# Altium schematic sheet pico.SchDoc: Pico
size C; DocumentNumber: 1; SheetNumber: 1; SheetTotal: 2
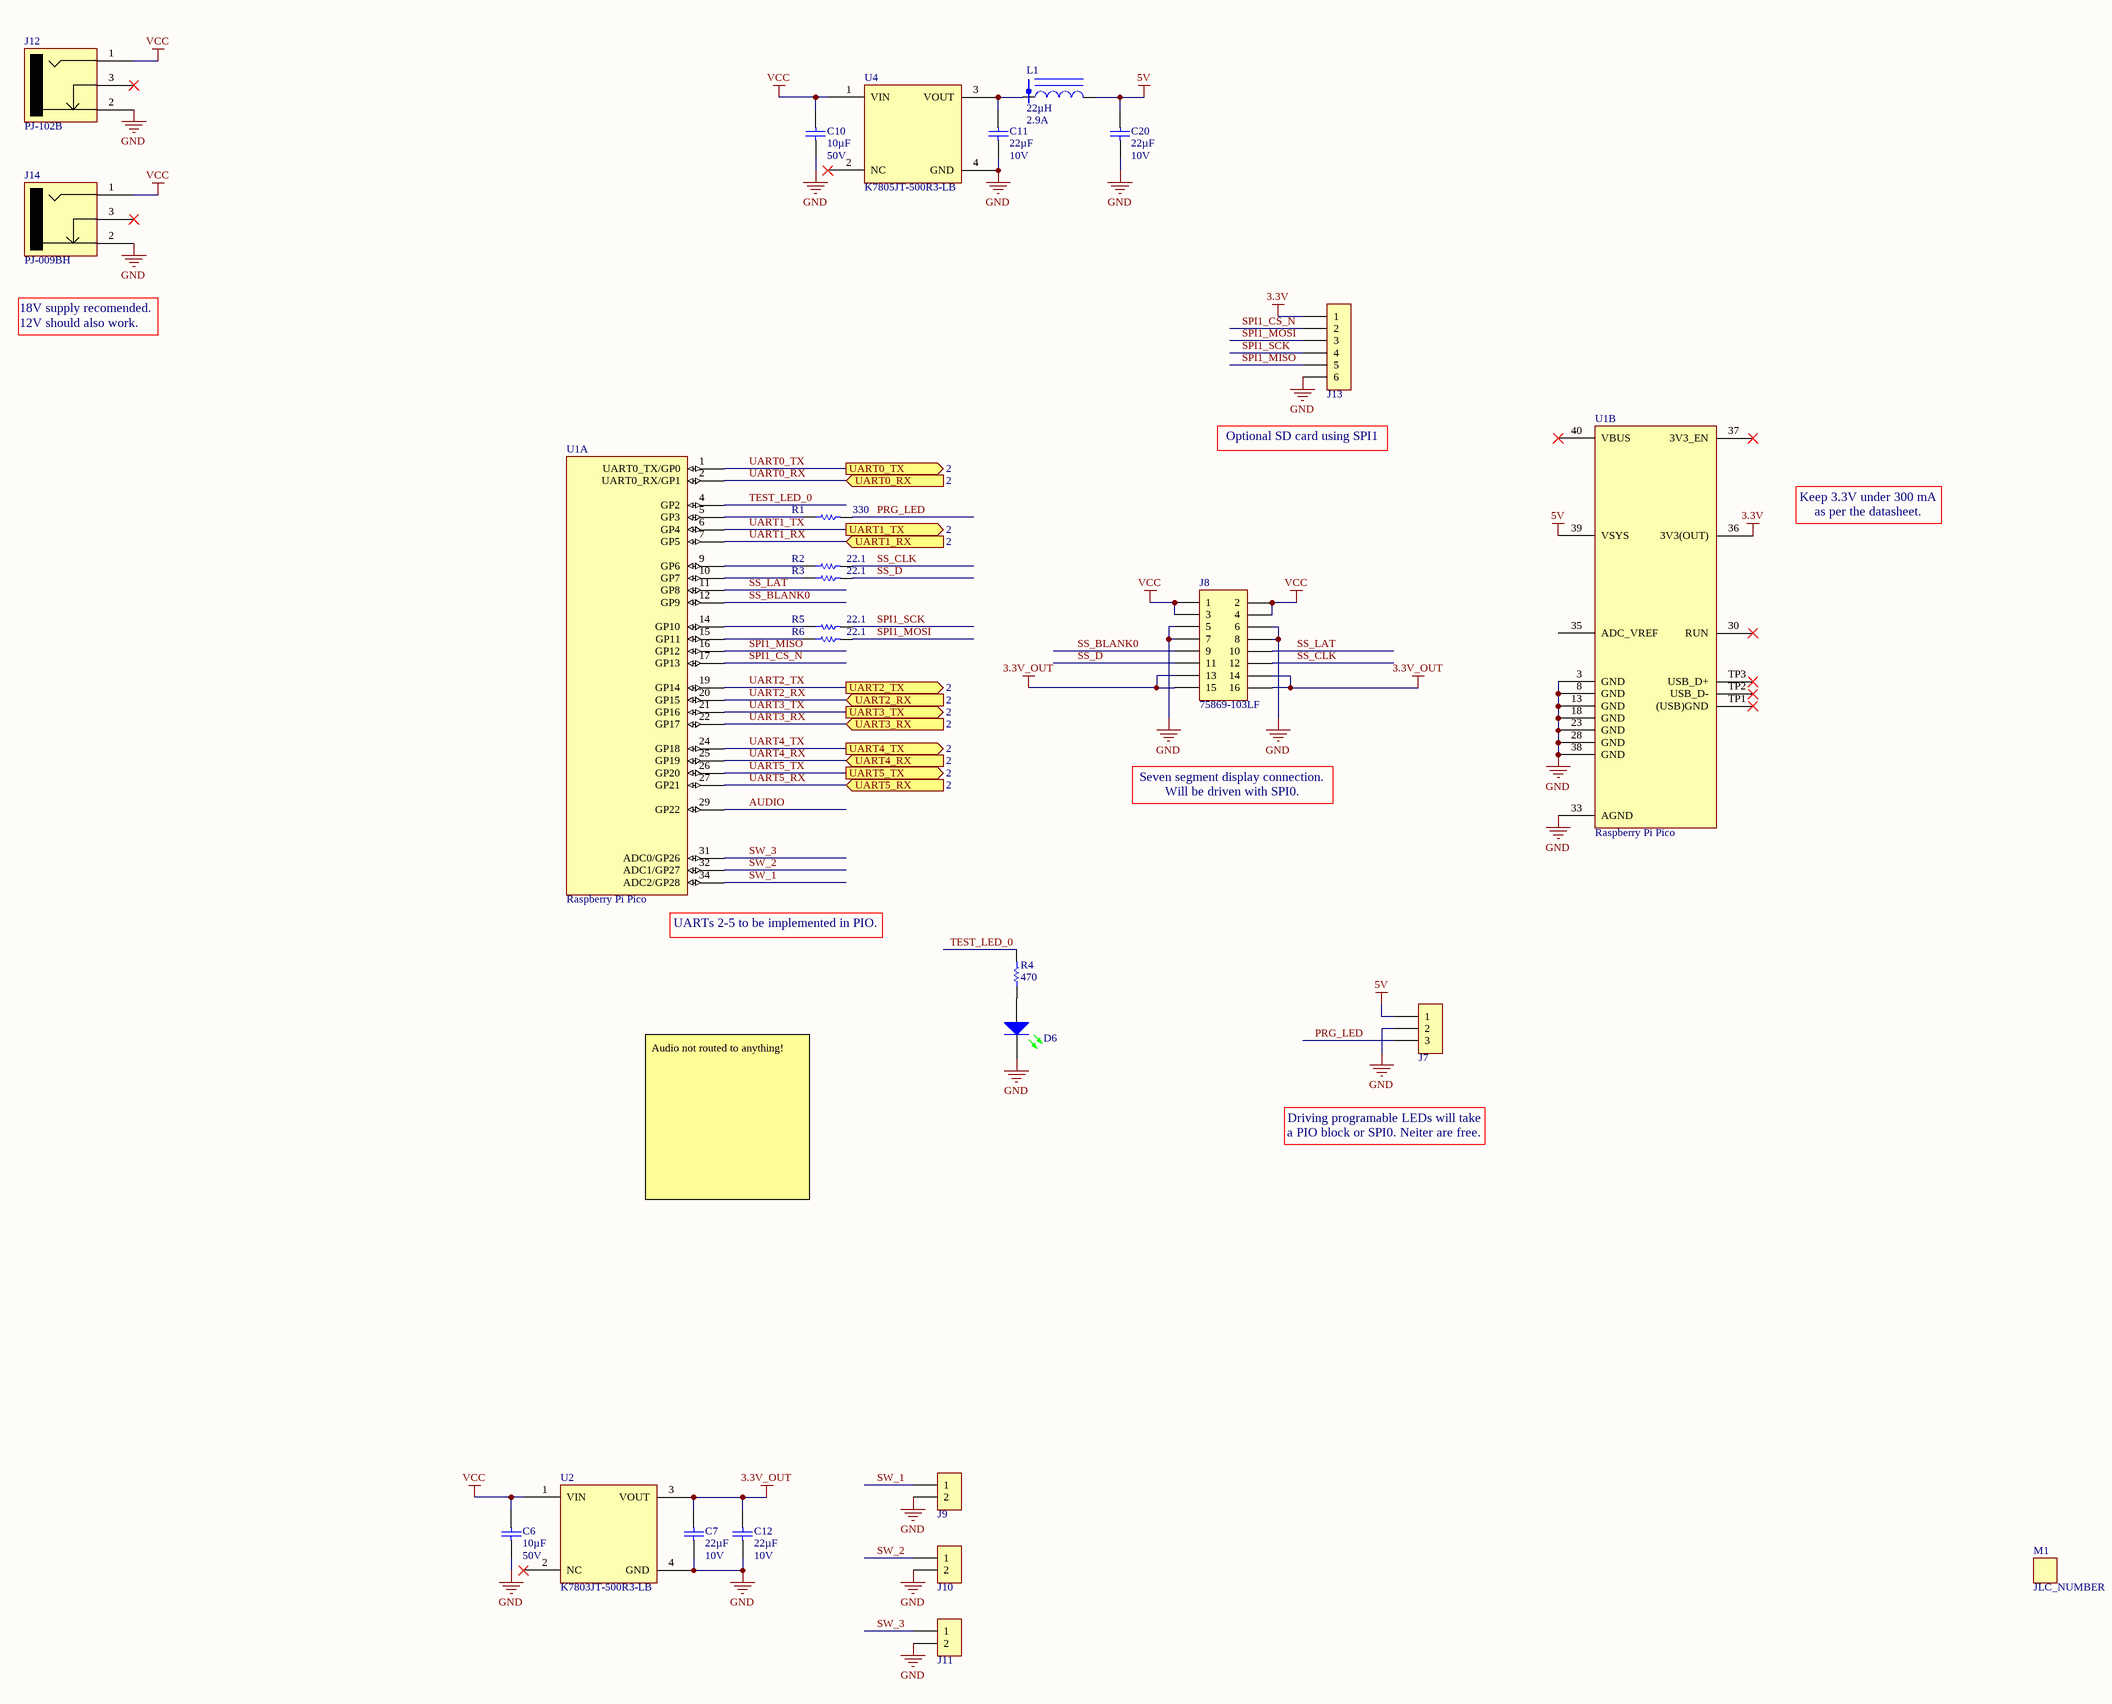
[diagram p0: pico.SchDoc]

## Parts
C6  10µF  Voltage: 50V  [Chip1206]
C7  22µF  Voltage: 10V  [Chip0805]
C10  10µF  Voltage: 50V  [Chip1206]
C11  22µF  Voltage: 10V  [Chip0805]
C12  22µF  Voltage: 10V  [Chip0805]
C20  22µF  Voltage: 10V  [Chip0805]
D6  GREEN  [LED0603]  (value not drawn)
J7  3-644456-3  [TE_3-644456-3]  (value not drawn)
J8  75869-103LF  [IDC_100_2x8]
J9  B2B-XH-A  [JST_B2B-XH-A]  (value not drawn)
J10  B2B-XH-A  [JST_B2B-XH-A]  (value not drawn)
J11  B2B-XH-A  [JST_B2B-XH-A]  (value not drawn)
J12  PJ-102B  [CUI_PJ-102B]
J13  3-644456-6  [TE_3-644456-6]  (value not drawn)
J14  PJ-009BH  [CUI_PJ-009BH]
L1  22µH  Current Rating: 2.9A  [Sumida_CDRH105R]
M1  JLC_NUMBER  [JLC_NUMBER]  (no BOM)
R1  330  [Chip0805]
R2  22.1  [Chip0805]
R3  22.1  [Chip0805]
R4  470  [Chip0805]
R5  22.1  [Chip0805]
R6  22.1  [Chip0805]
U1  Raspberry Pi Pico  [RASPBERRY_PI_PICO]  (parts A,B of 2)
U2  K7803JT-500R3-LB  [MORNSUN_K78XXJT-500R3-LB]
U4  K7805JT-500R3-LB  [MORNSUN_K78XXJT-500R3-LB]

## Ports
UART0_RX (in, see 2), UART0_TX (out, see 2), UART1_RX (in, see 2), UART1_TX (out, see 2), UART2_RX (in, see 2), UART2_TX (out, see 2), UART3_RX (in, see 2), UART3_TX (out, see 2), UART4_RX (in, see 2), UART4_TX (out, see 2), UART5_RX (in, see 2), UART5_TX (out, see 2)

## Nets
3.3V: J13.1 U1.36(3V3(OUT))
3.3V_OUT: C7.2 C12.2 J8.13 J8.14 J8.15 J8.16 U2.3(VOUT)
5V: C20.2 J7.1 L1.2 U1.39(VSYS)
GND: C6.1 C7.1 C10.1 C11.1 C12.1 C20.1 D6.2(C) J7.2 J8.5 J8.6 J8.7 J8.8 J9.2 J10.2 J11.2 J12.2 J13.6 J14.2 U1.3(GND) U1.8(GND) U1.13(GND) U1.18(GND) U1.23(GND) U1.28(GND) U1.33(AGND) U1.38(GND) U2.4(GND) U4.4(GND)
VCC: C6.2 C10.2 J8.1 J8.2 J8.3 J8.4 J12.1 J14.1 U2.1(VIN) U4.1(VIN)
AUDIO: U1.29(GP22)
PRG_LED: J7.3 R1.2
SPI1_CS_N: J13.2 U1.17(GP13)
SPI1_MISO: J13.5 U1.16(GP12)
SPI1_MOSI: J13.3 R6.2
SPI1_SCK: J13.4 R5.2
SS_BLANK0: J8.9 U1.12(GP9)
SS_CLK: J8.12 R2.2
SS_D: J8.11 R3.2
SS_LAT: J8.10 U1.11(GP8)
SW_1: J9.1 U1.34(ADC2/GP28)
SW_2: J10.1 U1.32(ADC1/GP27)
SW_3: J11.1 U1.31(ADC0/GP26)
TEST_LED_0: R4.2 U1.4(GP2)
UART0_RX: U1.2(UART0_RX/GP1) ; port UART0_RX
UART0_TX: U1.1(UART0_TX/GP0) ; port UART0_TX
UART1_RX: U1.7(GP5) ; port UART1_RX
UART1_TX: U1.6(GP4) ; port UART1_TX
UART2_RX: U1.20(GP15) ; port UART2_RX
UART2_TX: U1.19(GP14) ; port UART2_TX
UART3_RX: U1.22(GP17) ; port UART3_RX
UART3_TX: U1.21(GP16) ; port UART3_TX
UART4_RX: U1.25(GP19) ; port UART4_RX
UART4_TX: U1.24(GP18) ; port UART4_TX
UART5_RX: U1.27(GP21) ; port UART5_RX
UART5_TX: U1.26(GP20) ; port UART5_TX
NetC11_2: C11.2 L1.1 U4.3(VOUT)
NetD6_1: D6.1(A) R4.1
NetR1_1: R1.1 U1.5(GP3)
NetR2_1: R2.1 U1.9(GP6)
NetR3_1: R3.1 U1.10(GP7)
NetR5_1: R5.1 U1.14(GP10)
NetR6_1: R6.1 U1.15(GP11)

Not connected (* = marked no-connect by the designer): J12 3*; J14 3*; U1 30(RUN)* 35(ADC_VREF) 37(3V3_EN)* 40(VBUS)* TP1((USB)GND)* TP2(USB_D-)* TP3(USB_D+)*; U2 2(NC)*; U4 2(NC)*

## Notes on the sheet
- 18V supply recomended. 12V should also work.
- Optional SD card using SPI1
- Keep 3.3V under 300 mA as per the datasheet.
- Seven segment display connection. Will be driven with SPI0.
- (near U1) UARTs 2-5 to be implemented in PIO.
- Driving programable LEDs will take a PIO block or SPI0. Neiter are free.
- Audio not routed to anything!
- Title:
- This work is licensed under a Creative Commons Attribution 4.0 International License. Derivative works should remove all Sophistry branding and ‘é’ watermark.
- Date:
- Engineer:
- Revision:
- Codename:
- Time:
- Variant:
- Sheet
- of

## Library data of the parts
C6 C10 = C3216X5R1H106K160AB: CAP CER 10UF 50V 10% X5R 1206; Manufacturer: TDK Corporation; PartNumber: C3216X5R1H106K160AB; HelpURL: http://product.tdk.com/capacitor/mlcc/en/documents/mlcc_commercial_general_en.pdf; Supplier 1: Digi-Key; Supplier Part Number 1: 445-5998-1-ND; Supplier 2: Mouser; Manufacturer Part Number: C3216X5R1H106K160AB; Series: C; Capacitance: 10µF; Tolerance: ±10%; Temperature Coefficient: X5R; Mounting Type: Surface Mount, MLCC; Operating Temperature: -55°C ~ 85°C; Applications: General Purpose; Ratings: -; Package / Case: 1206 (3216 Metric); Size / Dimension: 0.126" L x 0.063" W (3.20mm x 1.60mm); Height - Seated (Max): -; Thickness (Max): 0.071" (1.80mm); Lead Spacing: -; Features: -; Lead Style: -
C7 C11 C12 C20 = C2012X5R1A226M085AC: CAP CER 22UF 10V 20% X5R 0805; Manufacturer: TDK Corporation; PartNumber: C2012X5R1A226M085AC; HelpURL: http://product.tdk.com/capacitor/mlcc/en/documents/mlcc_commercial_general_en.pdf; Supplier 1: Digi-Key; Supplier Part Number 1: 445-7663-1-ND; Supplier 2: Mouser; Manufacturer Part Number: C2012X5R1A226M085AC; Series: C; Capacitance: 22µF; Tolerance: ±20%; Temperature Coefficient: X5R; Mounting Type: Surface Mount, MLCC; Operating Temperature: -55°C ~ 85°C; Applications: General Purpose; Ratings: -; Package / Case: 0805 (2012 Metric); Size / Dimension: 0.079" L x 0.049" W (2.00mm x 1.25mm); Height - Seated (Max): -; Thickness (Max): 0.037" (0.95mm); Lead Spacing: -; Features: -; Lead Style: -
D6 = LTST-C191GKT: LED GREEN CLEAR THIN 0603 SMD; Manufacturer: Lite-On Inc; PartNumber: LTST-C191GKT; Datasheets: http://optoelectronics.liteon.com/upload/download/DS22-2000-300/S_110_LTST-C191TGKT.pdf; Supplier 1: Digi-Key; Supplier Part Number 1: 160-1443-1-ND; Supplier 2: Mouser; Supplier Part Number 2: 859-LTST-C191GKT; Manufacturer Part Number: LTST-C191GKT; Color: Green
J7 = 3-644456-3: CONN HEADER VERT 3POS .100 TIN; Manufacturer: TE Connectivity; PartNumber: 3-644456-3; Supplier 1: Digi-Key; Supplier 2: Mouser; Supplier Part Number 2: 571-3-644456-3; HelpURL: http://www.te.com/commerce/DocumentDelivery/DDEController?Action=srchrtrv&DocNm=644456&DocType=Customer+Drawing&DocLang=English; Supplier Part Number 1: A31113-ND; Manufacturer Part Number: 3-644456-3
J8 = 75869-103LF: CONN HEADER 16POS DUAL VERT PCB; Manufacturer: FCI; PartNumber: 75869-103LF; Supplier 1: Digi-Key; Supplier 2: Mouser; Supplier Part Number 2: 649-75869-103LF; HelpURL: http://portal.fciconnect.com/Comergent//fci/drawing/75869.pdf; Supplier Part Number 1: 609-1775-ND; Manufacturer Part Number: 75869-103LF
J9-J11 = B2B-XH-A: CONN HEADER VERT 2POS 2.5MM; Manufacturer: JST Sales America Inc.; PartNumber: B2B-XH-A; Supplier 1: Digi-Key; Supplier 2: Mouser; HelpURL: https://www.jst-mfg.com/product/pdf/eng/eXH.pdf; Supplier Part Number 1: 455-B2B-XH-A-ND; Manufacturer Part Number: B2B-XH-A
J12 = PJ-102B: CONN PWR JACK 2.5X5.5MM SOLDER; Manufacturer: CUI Devices; PartNumber: PJ-102B; HelpURL: https://www.cuidevices.com/product/resource/pj-102b.pdf; Supplier 1: Digi-Key; Supplier Part Number 1: CP-102B-ND; Supplier 2: Mouser; Supplier Part Number 2: 490-PJ-102B; Manufacturer Part Number: PJ-102B
J13 = 3-644456-6: CONN HEADER VERT 6POS .100 TIN; Manufacturer: TE Connectivity; PartNumber: 3-644456-6; Supplier 1: Digi-Key; Supplier 2: Mouser; Supplier Part Number 2: 571-3-644456-6; HelpURL: http://www.te.com/commerce/DocumentDelivery/DDEController?Action=srchrtrv&DocNm=644456&DocType=Customer+Drawing&DocLang=English; Supplier Part Number 1: A31116-ND; Manufacturer Part Number: 3-644456-6
J14 = PJ-009BH: CONN PWR JACK 2.5X5.5MM SOLDER; Manufacturer: CUI Devices; PartNumber: PJ-009BH; HelpURL: https://www.cuidevices.com/product/resource/pj-009bh.pdf; Supplier 1: Digi-Key; Supplier Part Number 1: CP-009BH-ND; Supplier 2: Mouser; Supplier Part Number 2: 490-PJ-009BH; Manufacturer Part Number: PJ-009BH
L1 = CDRH105RNP-220NC: INDUCTOR POWER 22UH 2.95A SMD; Manufacturer: Sumida America Components Inc; Type: 0; Material - Core: Ferrite; Tolerance: ±30%; Shielding: Shielded; DC Resistance (DCR): 61 mOhm Max; Frequency - Test: 100kHz; PartNumber: CDRH105RNP-220NC; Supplier 1: Digi-Key; Supplier 2: Mouser; HelpURL: http://www.sumida.com/products/pdf/CDRH105R.pdf; Supplier Part Number 1: 308-2173-1-ND; Manufacturer Part Number: CDRH105RNP-220NC; Series: CDRH105R; Inductance: 22µH; Current - Saturation: 2.95A; Q @ Freq: 0; Frequency - Self Resonant: 0; Operating Temperature: -40°C ~ 100°C; Mounting Type: Surface Mount; Package / Case: Non Standard; Size / Dimension: 0.402" L x 0.394" W (10.20mm x 10.00mm); Height - Seated (Max): 0.201" (5.10mm)
M1 = JLC_NUMBER: JLC Order Number Location; PartNumber: JLC_NUMBER; Manufacturer Part Number: JLC_NUMBER
R1 = CRCW0805330RFKEA: RES 330 OHM 1/8W 1% 0805 SMD; Manufacturer: Vishay Dale; Power (Watts): 0.125W, 1/8W; Temperature Coefficient: ±100ppm/°C; PartNumber: CRCW0805330RFKEA; HelpURL: http://www.vishay.com/doc?20035; Supplier 1: Digi-Key; Supplier Part Number 1: 541-330CCT-ND; Supplier 2: Mouser; Manufacturer Part Number: CRCW0805330RFKEA; Series: CRCW; Resistance: 330; Tolerance: ±1%; Composition: Thick Film; Features: Automotive AEC-Q200 Qualified; Package / Case: 0805 (2012 Metric); Supplier Device Package: 0805 (2012 Metric); Size / Dimension: 0.079" L x 0.049" W (2.00mm x 1.25mm); Height: 0.020" (0.50mm); Number of Terminations: 2
R2 R3 R5 R6 = CRCW080522R1FKEA: RES 22.1 OHM 1/8W 1% 0805 SMD; Manufacturer: Vishay Dale; Power (Watts): 0.125W, 1/8W; Temperature Coefficient: ±100ppm/°C; PartNumber: CRCW080522R1FKEA; HelpURL: http://www.vishay.com/doc?20035; Supplier 1: Digi-Key; Supplier Part Number 1: 541-22.1CCT-ND; Supplier 2: Mouser; Manufacturer Part Number: CRCW080522R1FKEA; Series: CRCW; Resistance: 22.1; Tolerance: ±1%; Composition: Thick Film; Features: Automotive AEC-Q200 Qualified; Package / Case: 0805 (2012 Metric); Supplier Device Package: 0805 (2012 Metric); Size / Dimension: 0.079" L x 0.049" W (2.00mm x 1.25mm); Height: 0.020" (0.50mm); Number of Terminations: 2
R4 = CRCW0805470RFKEA: RES 470 OHM 1/8W 1% 0805 SMD; Manufacturer: Vishay Dale; Power (Watts): 0.125W, 1/8W; Temperature Coefficient: ±100ppm/°C; PartNumber: CRCW0805470RFKEA; HelpURL: http://www.vishay.com/doc?20035; Supplier 1: Digi-Key; Supplier Part Number 1: 541-470CCT-ND; Supplier 2: Mouser; Manufacturer Part Number: CRCW0805470RFKEA; Series: CRCW; Resistance: 470; Tolerance: ±1%; Composition: Thick Film; Features: Automotive AEC-Q200 Qualified; Package / Case: 0805 (2012 Metric); Supplier Device Package: 0805 (2012 Metric); Size / Dimension: 0.079" L x 0.049" W (2.00mm x 1.25mm); Height: 0.020" (0.50mm); Number of Terminations: 2
U1 = Raspberry Pi Pico: RASPBERRY PI PICO RP2040 BOARD; Manufacturer Part Number: SC0915; PartNumber: Raspberry Pi Pico; Supplier 1: Digi-Key; Supplier Part Number 1: 2648-SC0915CT-ND; Manufacturer: Raspberry Pi
U2 = K7803JT-500R3-LB: LINEAR REGULATOR REPLACEMENT DC; Manufacturer: Mornsun America, LLC; PartNumber: K7803JT-500R3-LB; HelpURL: https://www.mornsun-power.com/html/pdf/K7803JT-500R3-LB.html; Supplier 1: Digi-Key; Supplier Part Number 1: 2725-K7803JT-500R3-LBCT-ND; Manufacturer Part Number: K7803JT-500R3-LB
U4 = K7805JT-500R3-LB: LINEAR REGULATOR REPLACEMENT DC; Manufacturer: Mornsun America, LLC; Output Type: Fixed; Number of Outputs: 1; Voltage - Output: 5V; Voltage - Input: 6.5-36V; Frequency - Switching: 700kHz; Current - Output: 500mA; PartNumber: K7805JT-500R3-LB; HelpURL: https://www.mornsun-power.com/html/pdf/K7805JT-500R3-LB.html; Supplier 1: Digi-Key; Supplier Part Number 1: 2725-K7805JT-500R3-LBCT-ND; Manufacturer Part Number: K7805JT-500R3-LB